# EAGLE design untitled (EAGLE 8.6.3)
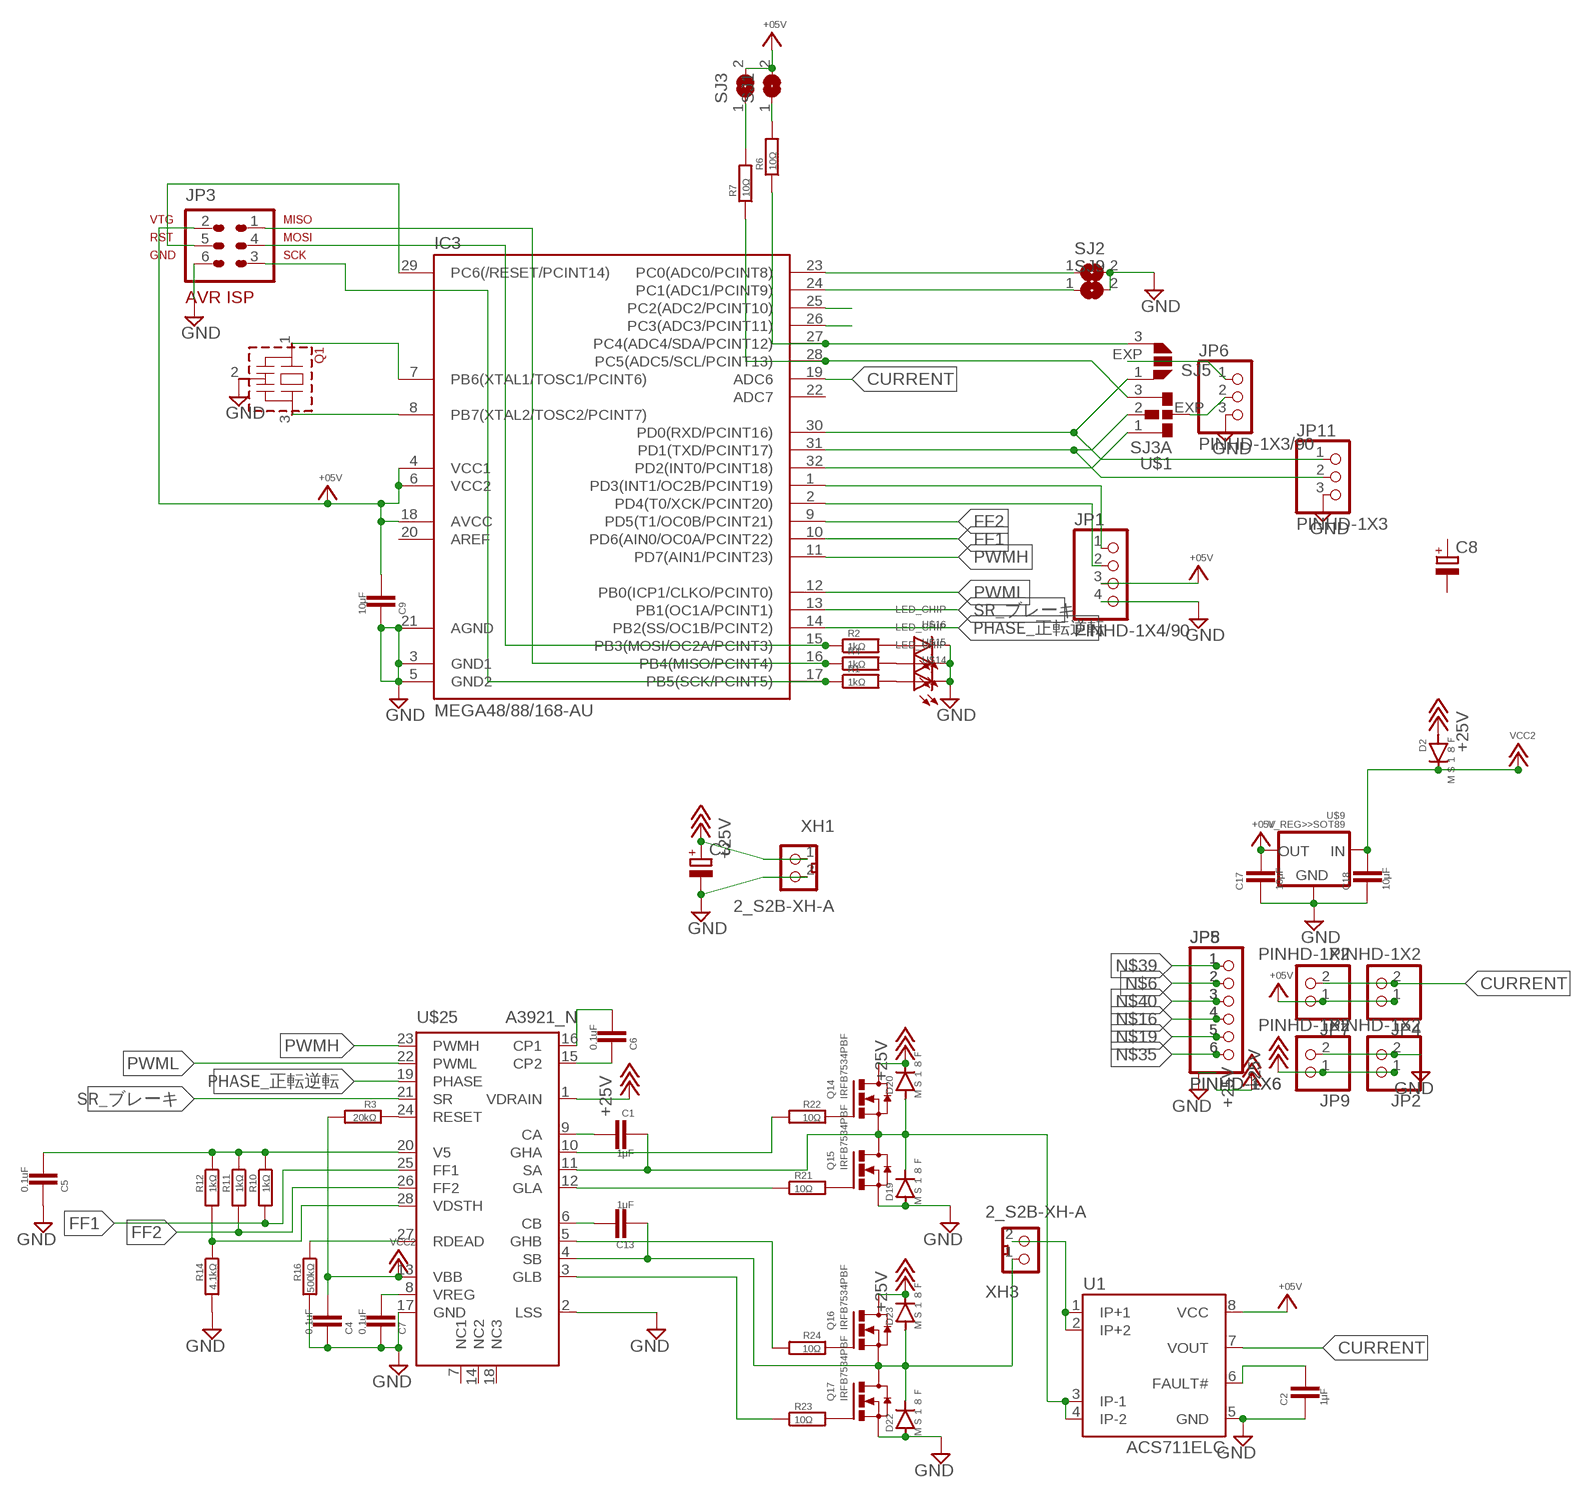
[diagram p0: schematic, sheet 1]

## Parts
C1  1μF  CAPACITOR>>2012  [2012]
C2  1μF  CAPACITOR>>2012  [2012]
C3  CPOL-EUUD-6,3X8,8  [UD-6,3X5,8_NICHICON]
C4  0.1uF  CAPACITOR>>2012  [2012]
C5  0.1uF  CAPACITOR>>2012  [2012]
C6  0.1uF  CAPACITOR>>2012  [2012]
C7  0.1uF  CAPACITOR>>2012  [2012]
C8  CPOL-EU150CLZ-1010  [150CLZ-1010]
C9  10μF  CAPACITOR>>2012  [2012]
C13  1μF  CAPACITOR>>2012  [2012]
C17  10μF  CAPACITOR>>2012  [2012]
C18  10μF  CAPACITOR>>2012  [2012]
D2  ＭＳ１８Ｆ  DIODE>>MS18F  [MS18F]
D19  ＭＳ１８Ｆ  DIODE>>MS18F  [MS18F]
D20  ＭＳ１８Ｆ  DIODE>>MS18F  [MS18F]
D22  ＭＳ１８Ｆ  DIODE>>MS18F  [MS18F]
D23  ＭＳ１８Ｆ  DIODE>>MS18F  [MS18F]
IC3  MEGA48/88/168-AU  [TQFP32-08]
JP1  PINHD-1X4/90  [1X04/90]
JP2  PINHD-1X2  [1X02]
JP3  AVR-ISP-6  [AVR-ISP-6]
JP4  PINHD-1X2  [1X02]
JP5  PINHD-1X6  [1X06]
JP6  PINHD-1X3/90  [1X03/90]
JP7  PINHD-1X2  [1X02]
JP8  PINHD-1X6  [1X06]
JP9  PINHD-1X2  [1X02]
JP11  PINHD-1X3  [1X03]
Q1  CSTLS_G  [CSTLS_G8]
Q14  IRFB7534PBF  MOSFET_N>>TO252  [TO252]
Q15  IRFB7534PBF  MOSFET_N>>TO252  [TO252]
Q16  IRFB7534PBF  MOSFET_N>>TO252  [TO252]
Q17  IRFB7534PBF  MOSFET_N>>TO252  [TO252]
R1  1kΩ  REGISTER>>2012  [2012]
R2  1kΩ  REGISTER>>2012  [2012]
R3  20kΩ  REGISTER>>2012  [2012]
R4  1kΩ  REGISTER>>2012  [2012]
R6  10Ω  REGISTER>>2012  [2012]
R7  10Ω  REGISTER>>2012  [2012]
R10  1kΩ  REGISTER>>2012  [2012]
R11  1kΩ  REGISTER>>2012  [2012]
R12  1kΩ  REGISTER>>2012  [2012]
R14  4.1kΩ  REGISTER>>2012  [2012]
R16  500kΩ  REGISTER>>2012  [2012]
R21  10Ω  REGISTER>>2012  [2012]
R22  10Ω  REGISTER>>2012  [2012]
R23  10Ω  REGISTER>>2012  [2012]
R24  10Ω  REGISTER>>2012  [2012]
SJ1  SJSS  [SJ_B]
SJ2  SJSS  [SJ_B]
SJ3  SJSS  [SJ_B]
SJ5  SJ2  [SJ2_A]
SJ9  SJSS  [SJ_B]
U1  ACS711ELC  [SOIC8]
U$1  SJ3A  [SJ3_A]
U$9  V_REG>>SOT89  [SOT89]
U$14  LED_CHIP  [2012]
U$15  LED_CHIP  [2012]
U$16  LED_CHIP  [2012]
U$25  A3921_N  [TSSOP28_N]
XH1  2_S2B-XH-A  [S2B-XH-A]
XH3  2_S2B-XH-A  [S2B-XH-A]

## Nets
+5V: C9.1 C17.1 IC3.4(VCC1) IC3.6(VCC2) IC3.18(AVCC) JP1.3 JP3.2 JP4.1 JP7.1 SJ1.2 SJ3.2 U1.8(VCC) U$9.1(OUT) ; supply symbol labelled +05V
+18V: C3.+ D2.P$1(A) D20.P$2(C) D23.P$2(C) JP2.1 JP9.1 Q14.3(D) Q16.3(D) U$25.1(VDRAIN) XH1.1 ; supply symbol labelled +25V
CURRENT: IC3.19(ADC6) JP4.2 JP7.2 U1.7(VOUT)
FF1: IC3.10(PD6(AIN0/OC0A/PCINT22)) R10.2 U$25.25(FF1)
FF2: IC3.9(PD5(T1/OC0B/PCINT21)) R11.2 U$25.26(FF2)
GND: C2.2 C3.- C4.2 C5.2 C7.2 C9.2 C17.2 C18.2 D19.P$1(A) D22.P$1(A) IC3.3(GND1) IC3.5(GND2) IC3.21(AGND) JP1.4 JP2.2 JP3.6 JP6.3 JP9.2 JP11.3 Q1.2(VSS) Q15.2(S) Q17.2(S) R14.2 R16.2 SJ2.2 SJ9.2 U1.5(GND) U$9.2(GND) U$9.2.1(GND) U$14.P$2(C) U$15.P$2(C) U$16.P$2(C) U$25.2(LSS) U$25.17(GND) XH1.2
N$1: IC3.1(PD3(INT1/OC2B/PCINT19)) JP1.1
N$2: R6.2 SJ1.1
N$3: U1.1(IP+1) U1.2(IP+2) XH3.2
N$4: C6.1 U$25.16(CP1)
N$5: IC3.29(PC6(/RESET/PCINT14)) JP3.5
N$6: C13.2 D22.P$2(C) D23.P$1(A) JP5.2 JP8.2 Q16.2(S) Q17.3(D) U$25.4(SB) XH3.1
N$7: IC3.7(PB6(XTAL1/TOSC1/PCINT6)) Q1.1
N$8: IC3.8(PB7(XTAL2/TOSC2/PCINT7)) Q1.3
N$9: R1.2 U$14.P$1(A)
N$10: IC3.2(PD4(T0/XCK/PCINT20)) JP1.2
N$11: IC3.17(PB5(SCK/PCINT5)) JP3.3 R1.1
N$14: C1.1 U$25.9(CA)
N$15: R4.2 U$15.P$1(A)
N$16: JP5.4 JP8.4 R22.2 U$25.10(GHA)
N$17: R2.2 U$16.P$1(A)
N$18: JP6.2 U$1.EXP
N$19: C1.2 D19.P$2(C) D20.P$1(A) JP5.5 JP8.5 Q14.2(S) Q15.3(D) U1.3(IP-1) U1.4(IP-2) U$25.11(SA)
N$20: R7.2 SJ3.1
N$21: IC3.15(PB3(MOSI/OC2A/PCINT3)) JP3.4 R2.1
N$22: IC3.16(PB4(MISO/PCINT4)) JP3.1 R4.1
N$23: JP6.1 SJ5.EXP
N$24: IC3.32(PD2(INT0/PCINT18)) U$1.1
N$25: IC3.23(PC0(ADC0/PCINT8)) SJ2.1
N$26: IC3.24(PC1(ADC1/PCINT9)) SJ9.1
N$27: IC3.31(PD1(TXD/PCINT17)) JP11.2 U$1.2
N$28: IC3.30(PD0(RXD/PCINT16)) JP11.1 SJ5.1
N$29: C6.2 U$25.15(CP2)
N$30: IC3.28(PC5(ADC5/SCL/PCINT13)) R7.1 U$1.3
N$31: IC3.27(PC4(ADC4/SDA/PCINT12)) R6.1 SJ5.3
N$32: IC3.25(PC2(ADC2/PCINT10))
N$33: IC3.26(PC3(ADC3/PCINT11))
N$35: JP5.6 JP8.6 R21.1 U$25.12(GLA)
N$36: R3.1 U$25.24(RESET)
N$37: C7.1 U$25.8(VREG)
N$39: JP5.1 JP8.1 R24.2 U$25.5(GHB)
N$40: JP5.3 JP8.3 R23.1 U$25.3(GLB)
N$41: C13.1 U$25.6(CB)
N$43: R12.2 R14.1 U$25.28(VDSTH)
N$50: Q15.1(G) R21.2
N$51: R16.1 U$25.27(RDEAD)
N$52: C2.1 U1.6(FAULT#)
N$54: Q14.1(G) R22.1
N$56: Q17.1(G) R23.2
N$60: Q16.1(G) R24.1
PHASE_正転逆転: IC3.14(PB2(SS/OC1B/PCINT2)) U$25.19(PHASE)
PWMH: IC3.11(PD7(AIN1/PCINT23)) U$25.23(PWMH)
PWML: IC3.12(PB0(ICP1/CLKO/PCINT0)) U$25.22(PWML)
SR_ブレーキ: IC3.13(PB1(OC1A/PCINT1)) U$25.21(SR)
V5: C5.1 R10.1 R11.1 R12.1 U$25.20(V5)
VCC2: C4.1 C18.1 D2.P$2(C) R3.2 U$9.3(IN) U$25.13(VBB)
Unconnected: C8.+ C8.- IC3.20(AREF) IC3.22(ADC7) U$25.7(NC1) U$25.14(NC2) U$25.18(NC3)

## Library data of the parts
C1 C2 C4-C7 C9 C13 C17 C18 = !SMD:CAPACITOR>>
C3 C8 = !rcl:CPOL-EU: POLARIZED CAPACITOR, European symbol
D2 D19 D20 D22 D23 = !diode:DIODE>>: DIODE
IC3 = !avr:MEGA48/88/168
JP1 = !pinhead(ﾋﾟﾝﾍｯﾀﾞ):PINHD-1X4: PIN HEADER
JP2 JP4 JP7 JP9 = !pinhead(ﾋﾟﾝﾍｯﾀﾞ):PINHD-1X2: PIN HEADER
JP3 = !avr:AVR-ISP-6: AVR ISP-6 Serial Programming Header
JP5 JP8 = !pinhead(ﾋﾟﾝﾍｯﾀﾞ):PINHD-1X6: PIN HEADER
JP6 JP11 = !pinhead(ﾋﾟﾝﾍｯﾀﾞ):PINHD-1X3: PIN HEADER
Q1 = !murata-resonators(ｾﾗﾛｯｸ):CSTLS_G: Ceramic resonator 2.00 to 10.00 MHz
Q14-Q17 = !FET_transister_v-reg:MOSFET_N>>
R1-R4 R6 R7 R10-R12 R14 R16 R21-R24 = !SMD:REGISTER>>
SJ1-SJ3 SJ9 = !jumper:SJ: SMD solder JUMPER
SJ5 = !jumper:SJ2: SMD solder JUMPER
U1 = allegro:ACS711E: SENSOR CURRENT 3.3V 8-SOIC tested: YES (etherbotix)
U$1 = !jumper:SJ3
U$9 = !FET_transister_v-reg:V_REG>>
U$14-U$16 = !led:LED_CHIP
U$25 = !irs(GateDriver):A3921_N
XH1 XH3 = !con-xh:2_: Wire-to-Board 2.5mm pitch top mount connector Source: http://www.jst-mfg.com/product/pdf/jpn/XH.pdf http://www.jst-mfg.com/product/detail.php?series=277

## Board
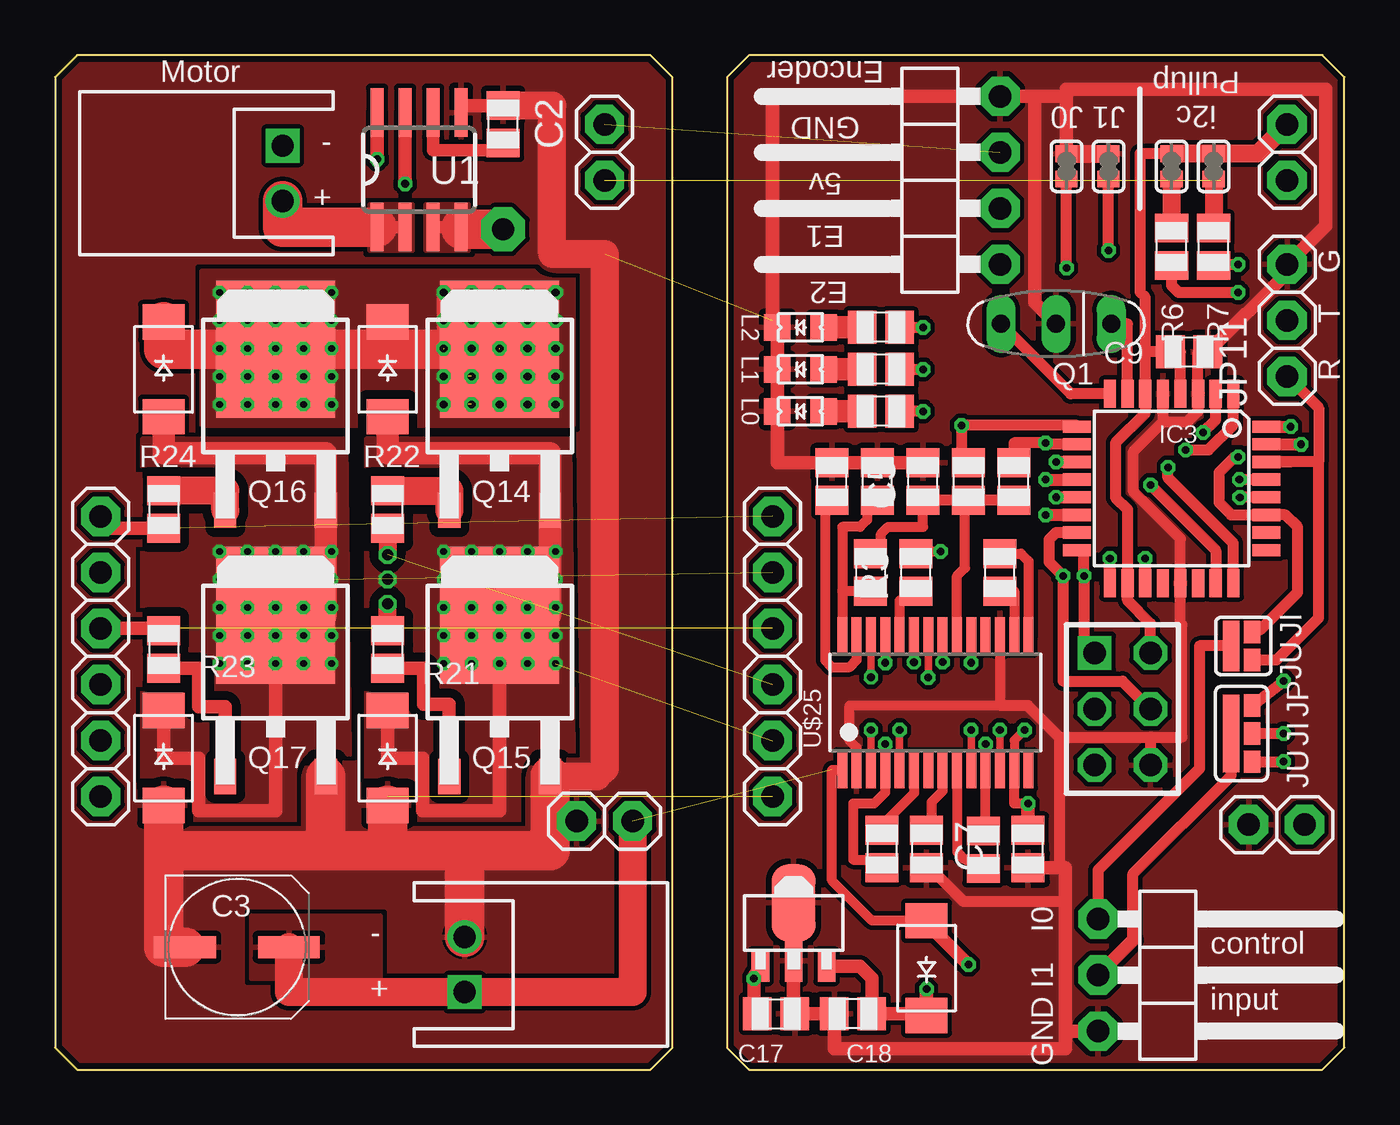
[diagram p1: board, top side]
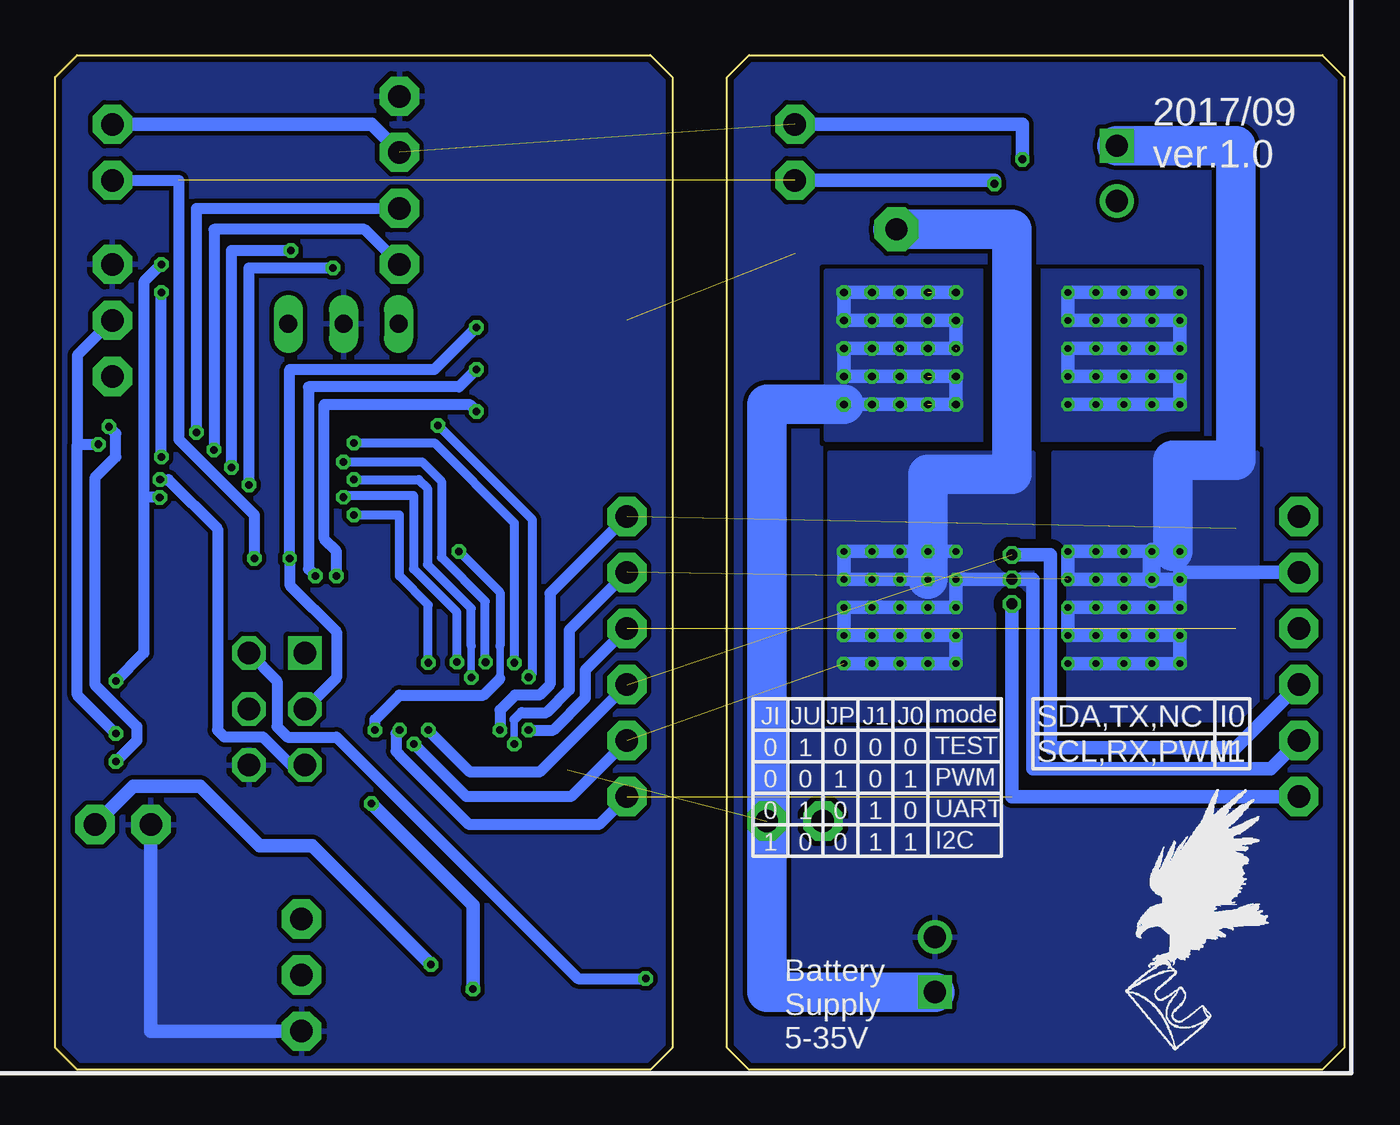
[diagram p2: board, bottom side, seen from below]

Size 58.48 x 46 mm. Coordinates in mm from the lower left corner, seen from the top.
Outline: 28,1 28,45 27,46 1,46 0,45 0,1 1,0 27,0 28,1
Outline: 58.48,1 58.48,45 57.48,46 31.48,46 30.48,45 30.48,1 31.48,0 57.48,0 58.48,1
Copper layers (1*16): Top 0.035mm / dielectric 1.5mm / Bottom 0.035mm
Design rules "SeeedStudio_2layer_DRU_no_angle_20140221": minimum track width 6mil, minimum drill 12mil, track to track 6mil, track to pad 6mil, pad to pad 6mil, via to via 6mil, smd to smd 0mil, copper to edge 10mil, drill to drill 10mil, minimum pad ring 10mil, minimum via ring 6mil, stop-mask expansion 2mil, vias tented up to drill 100mil, thermal gap 10mil

### Footprints (pad centres in the part's own frame; a part is rotated, then mirrored left to right if it is on the bottom)
2012 = smd 1.3 x 1.5: 1 -0.85,0; 2 0.85,0
UD-6,3X5,8_NICHICON = smd 2.8 x 1: + 2.35,0; - -2.35,0
150CLZ-1010 = smd 4.3 x 2.5: + 4.15,0; - -4.15,0
MS18F = smd 1.6 x 1.9: P$1 -2.15,0; P$2 2.15,0
TQFP32-08 = smd 1.27 x 0.559: 1 -4.293,2.8; 2 -4.293,2; 3 -4.293,1.2; 4 -4.293,0.4; 5 -4.293,-0.4; 6 -4.293,-1.2; 7 -4.293,-2; 8 -4.293,-2.8; 17 4.293,-2.8; 18 4.293,-2; 19 4.293,-1.2; 20 4.293,-0.4; 21 4.293,0.4; 22 4.293,1.2; 23 4.293,2; 24 4.293,2.8 | smd 0.559 x 1.27: 9 -2.8,-4.293; 10 -2,-4.293; 11 -1.2,-4.293; 12 -0.4,-4.293; 13 0.4,-4.293; 14 1.2,-4.293; 15 2,-4.293; 16 2.8,-4.293; 25 2.8,4.293; 26 2,4.293; 27 1.2,4.293; 28 0.4,4.293; 29 -0.4,4.293; 30 -1.2,4.293; 31 -2,4.293; 32 -2.8,4.293
1X04/90 = drill 1.016 pad 1.778 octagon: 1 -3.81,-3.81; 2 -1.27,-3.81; 3 1.27,-3.81; 4 3.81,-3.81
1X02 = drill 1.016 pad 1.778 octagon: 1 -1.27,0; 2 1.27,0
AVR-ISP-6 = drill 1.016 square: 1 -2.54,-1.27 | drill 1.016 octagon: 2 -2.54,1.27; 3 0,-1.27; 4 0,1.27; 5 2.54,-1.27; 6 2.54,1.27
1X06 = drill 1.016 pad 1.778 octagon: 1 -6.35,0; 2 -3.81,0; 3 -1.27,0; 4 1.27,0; 5 3.81,0; 6 6.35,0
1X03/90 = drill 1.016 pad 1.778 octagon: 1 -2.54,-3.81; 2 0,-3.81; 3 2.54,-3.81
1X03 = drill 1.016 pad 1.778 octagon: 1 -2.54,0; 2 0,0; 3 2.54,0
CSTLS_G8 = drill 0.813 long: 1 -2.5,0; 2 0,0; 3 2.5,0
TO252 = smd 1 x 1.6: 1 -2.28,-4.8; 2 2.28,-4.8 | smd 5.4 x 6.2: 3 0,2.5
SJ_B = smd 0.75 x 1: 1 -0.572,0; 2 0.572,0
SJ2_A = smd 1 x 0.75: 1 -0.635,-0.953; 3 0.635,-0.953 | smd 2.3 x 0.75: EXP 0,0
SOIC8 = smd 0.6 x 2.2: 1 -1.905,-2.6; 2 -0.635,-2.6; 3 0.635,-2.6; 4 1.905,-2.6; 5 1.905,2.6; 6 0.635,2.6; 7 -0.635,2.6; 8 -1.905,2.6
SJ3_A = smd 1 x 0.75: 1 -1.111,-0.953; 2 0.159,-0.953; 3 1.429,-0.953 | smd 3.5 x 0.75: EXP 0.159,0
SOT89 = smd 0.8 x 1.4: 1 -1.499,-1.981; 3 1.499,-1.981 | smd 0.8 x 1.9: 2 0,-1.727 | smd 2 x 3.5: 2.1 0,0.889
2012' = smd 1.2 x 1.2: P$1 -1.05,0; P$2 1.05,0
TSSOP28_N = smd 0.45 x 1.65: 1 -4.225,-3.05; 2 -3.575,-3.05; 3 -2.925,-3.05; 4 -2.275,-3.05; 5 -1.625,-3.05; 6 -0.975,-3.05; 7 -0.325,-3.05; 8 0.325,-3.05; 9 0.975,-3.05; 10 1.625,-3.05; 11 2.275,-3.05; 12 2.925,-3.05; 13 3.575,-3.05; 14 4.225,-3.05; 15 4.225,3.05; 16 3.575,3.05; 17 2.925,3.05; 18 2.275,3.05; 19 1.625,3.05; 20 0.975,3.05; 21 0.325,3.05; 22 -0.325,3.05; 23 -0.975,3.05; 24 -1.625,3.05; 25 -2.275,3.05; 26 -2.925,3.05; 27 -3.575,3.05; 28 -4.225,3.05
S2B-XH-A = drill 1.016 square: 1 1.25,0 | drill 1.016: 2 -1.25,0

### Placement (x,y rotation side)
C1  42.1,9.96 90 top
C2  20.32,42.86 90 top
C3  8.26,5.56 0 top
C4  44.13,10 270 top
C5  39.37,26.67 90 top
C6  42.86,22.54 90 top
C7  39.53,10 270 top
C8  -9.52,6.03 0 top  (outside the outline)
C9  51.44,32.54 0 top
C13  37.5,10 270 top
C17  32.7,2.54 0 top
C18  36.2,2.54 180 top
D2  39.53,4.6 270 top
D19  15.08,14.13 90 top
D20  15.08,31.75 90 top
D22  4.92,14.13 90 top
D23  4.92,31.75 90 top
IC3  50.64,26.35 270 top
JP1  39.05,40.32 90 top
JP2  55.4,11.11 180 top
JP3  48.42,16.35 270 top
JP4  55.88,41.59 270 top
JP5  32.54,18.73 270 top
JP6  51.12,4.29 270 top
JP7  24.92,41.59 270 top
JP8  2.06,18.73 270 top
JP9  24.92,11.27 180 top
JP11  55.88,33.97 90 top
Q1  45.4,33.81 180 top
Q14  20.16,30.16 0 top
Q15  20.16,18.1 0 top
Q16  10,30.16 0 top
Q17  10,18.1 0 top
R1  37.47,33.66 180 top
R2  37.47,29.84 180 top
R3  39.05,22.54 90 top
R4  37.47,31.75 180 top
R6  50.64,37.31 90 top
R7  52.55,37.31 90 top
R10  43.5,26.67 90 top
R11  41.43,26.67 90 top
R12  36.99,22.54 270 top
R14  37.31,26.67 90 top
R16  35.24,26.67 90 top
R21  15.08,19.05 270 top
R22  15.08,25.4 270 top
R23  4.92,19.05 270 top
R24  4.92,25.4 270 top
SJ1  50.64,40.96 90 top
SJ2  45.88,40.96 90 top
SJ3  52.55,40.96 90 top
SJ5  53.34,19.21 90 top
SJ9  47.78,40.96 90 top
U1  16.51,40.8 0 top
U$1  53.34,15.08 90 top
U$9  33.5,6.67 0 top
U$14  LED_CHIP  [2012']  33.81,33.66 180 top
U$15  LED_CHIP  [2012']  33.81,31.75 180 top
U$16  LED_CHIP  [2012']  33.81,29.84 180 top
U$25  39.93,16.64 0 top
XH1  18.57,4.76 270 top
XH3  10.32,40.64 90 top

### Tracks (layer width: path | path; a pad name or v marks a point on that pad's centre or on a via)
+5V  (via drill 0.35)  (1 unrouted)
  Top 0.508: IC3.4 51.04,32.54 C9.1 | 49.44,32.54 IC3.6 49.44,29.76 48.1,28.42 48.1,25.94 48.64,25.4 IC3.18 48.64,21.27 49.69,20.23 JP3.2 | 50.08,32.54 C9.1 | C9.1 49.44,32.54 | SJ1.2 49.21,41.53 49.21,35.25 49.44,35.02 49.44,32.54
  Top 0.61: U1.8 v14.6,41.27 | U$9.1 31.69,4.21 v31.69,4.13 31.69,2.54 C17.1
  Top 0.813: SJ1.2 SJ3.2 54.55,41.53 JP4.1
  Bottom 0.508: JP3.2 48.42,17.62 48.42,15.56 47.94,15.08 45.72,15.08 34.77,4.13 v31.69,4.13
  Bottom 0.61: JP7.1 14.6,42.86 v14.6,41.27 | JP4.1 44.13,42.86 JP1.3
+18V  (via drill 0.3, 0.35)  (6 unrouted)
  Top 0.457: D2.P$1 37.06,6.75 35.24,8.57 35.24,13.59 U$25.1
  Top 0.61: Q16.3 v10,31.43 | Q14.3 17.62,32.66 v17.62,35.24 | v41.43,4.76 39.53,6.67 D2.P$1
  Top 1.27: 16.99,32.66 15.08,32.66 D20.P$2 | v10,33.97 Q16.3 9.7,33.3 | JP9.1 26.19,3.51 XH1.1 10.6,3.51 C3.+
  Top 1.8: Q14.3 16.99,32.66 Q16.3 4.92,32.66 D23.P$2
  Bottom 0.61: v7.46,35.24 v8.73,35.24 v10,35.24 v11.27,35.24 v12.54,35.24 v12.54,33.97 v11.27,33.97 v10,33.97 v8.73,33.97 v7.46,33.97 v7.46,32.7 v8.73,32.7 | 8.57,32.7 v10,32.7 v11.27,32.7 v12.54,32.7 v12.54,31.43 v11.27,31.43 v10,31.43 v8.73,31.43 v7.46,31.43 v7.46,30.16 v8.73,30.16 v10,30.16 v11.27,30.16 v12.54,30.16 | v17.62,35.24 18.73,35.24 | v18.89,35.24 v20.16,35.24 v21.43,35.24 v22.7,35.24 v22.7,33.97 v21.43,33.97 v20.16,33.97 v18.89,33.97 | 18.73,33.97 v17.62,33.97 v17.62,32.7 18.73,32.7 | v18.89,32.7 v20.16,32.7 v21.43,32.7 v22.7,32.7 v22.7,31.43 v21.43,31.43 v20.16,31.43 v18.89,31.43 | 18.73,31.43 v17.62,31.43 v17.62,30.16 18.73,30.16 | v18.89,30.16 v20.16,30.16 v21.43,30.16 v22.7,30.16 | JP2.1 54.93,12.86 51.91,12.86 49.21,10.16 46.83,10.16 v41.43,4.76
  Bottom 1.8: 24.92,30.16 v22.7,30.16 26.19,30.16 JP9.1 26.19,3.51 XH1.1
  pour Top (isolate 0.406, rank 2, no thermals): 23.5,36.2 6.67,36.2 6.67,29.21 23.5,29.21
  pour Bottom (isolate 0.406, rank 2, no thermals): 6.67,36.2 23.5,36.2 23.5,28.58 6.67,28.58
  pour Top (isolate 0.406): 8.89,6.98 14.76,6.98 14.76,4.13 8.89,4.13
CURRENT  (via drill 0.35)  (1 unrouted)
  Top 0.55: IC3.19 v49.44,23.18
  Top 0.61: U1.7 v15.87,40.16
  Bottom 0.508: JP4.2 52.86,40.32 52.86,28.57 49.44,25.15 v49.44,23.18
  Bottom 0.61: JP7.2 15.87,40.32 v15.87,40.16
FF1  (via drill 0.35)
  Top 0.457: U$25.25 v37.65,18.45
  Top 0.508: IC3.10 44.93,28.35 v44.93,28.42 43.5,28.42 R10.2
  Bottom 0.406: v44.93,28.42 41.27,28.42 37.65,24.8 v37.65,18.45
FF2  (via drill 0.35)
  Top 0.34: U$25.26 v37,17.8
  Top 0.508: IC3.9 46.35,29.21 v41.12,29.21 41.12,27.52 R11.2
  Bottom 0.406: v37,17.8 36.83,17.97 36.83,24.92 v41.12,29.21
GND  (1 unrouted)
  Top 0.457: U$25.2 36.35,14.6 36.04,14.92 36.04,16.51 42.85,16.51 U$25.17 | U$9.2 U$9.2.1
  Top 0.508: C9.2 51.84,32.54 IC3.3 51.84,29.84 51.36,29.37 50.25,29.37 | U$14.P$2 32.54,33.72 32.54,33.97 | 49.69,15.08 51.12,15.08 51.12,20.16 51.04,20.16 IC3.21 51.04,24.07 48.92,26.19 48.92,28.04 50.25,29.37 | 49.69,15.08 JP3.6 | 50.24,29.77 IC3.5 50.24,29.38 50.25,29.37 | 45.81,7.62 41.22,7.62 39.69,9.15 C7.2 | 45.56,15.08 49.69,15.08 | 45.56,15.08 45.56,9.15 | 42.85,16.51 44.13,16.51 45.56,15.08
  Top 0.559: 20.32,43.4 C2.2
  Top 0.61: C2.2 18.41,43.71 U1.5 | 32.54,33.97 32.54,44.13 JP1.4 44.45,44.13 | 45.81,1.75 45.81,7.62 45.81,9.15 C4.2 | JP6.3 45.81,1.75 | U$9.2 33.5,2.22 C17.2 C18.2 35.34,0.95 45.81,0.95 45.81,1.75 | 34.13,7.08 U$9.2.1 | 44.45,44.13 45.88,44.13 | 45.88,44.13 SJ2.2 | 44.45,44.13 44.45,34.77 Q1.2 | C5.2 R14.2 R16.2 32.76,27.52 U$16.P$2 U$15.P$2 U$14.P$2 | 45.88,44.13 45.88,44.45 57.63,44.45 57.63,38.26 JP11.3 55.88,36.14 C9.2
  Top 0.813: SJ2.2 SJ9.2
  Top 1.27: C2.2 22.54,43.71 22.54,36.99 24.92,36.99 24.92,13.65 24.57,13.3 Q15.2 22.44,11.27 22.44,9.92 22.44,9.84 | 18.55,6.03 XH1.2
  Top 1.8: 18.57,9.92 22.44,9.92 Q15.2 | XH1.2 18.57,9.92 | 18.57,9.92 15.08,9.92 | 15.08,10 D19.P$1 15.08,9.92 | 15.08,9.92 12.28,9.92 | C3.- 4.92,5.56 4.92,10.29 | 4.92,10.29 D22.P$1 | 12.28,9.92 5.29,9.92 4.92,10.29 | JP9.2 22.44,11.27 | 12.28,9.92 Q17.2
  Bottom 0.61: JP2.2 54.13,1.75 JP6.3
  pour Bottom (isolate 0.203, rank 6): 28,1 27,0 1,0 0,1 0,45 1,46 27,46 28,45
  pour Top (isolate 0.203, rank 6): 28,1 27,0 1,0 0,1 0,45 1,46 27,46 28,45
  pour Top (isolate 0.203, rank 6): 58.48,1 57.48,0 31.48,0 30.48,1 30.48,45 31.48,46 57.48,46 58.48,45
  pour Bottom (isolate 0.203, rank 6): 58.48,1 57.48,0 31.48,0 30.48,1 30.48,45 31.48,46 57.48,46 58.48,45
N$1  (via drill 0.35)
  Top 0.508: v51.28,28.1 52.31,28.1 53.44,29.23 IC3.1
  Bottom 0.508: JP1.1 44.45,38.1 51.28,38.1 v51.28,28.1
N$2
  Top 0.813: SJ1.1 R6.2
N$3
  Top 0.559: U1.2 U1.1
  Top 1.8: U1.1 10.32,38.2 XH3.2
  pour Top (isolate 0.406, rank 2, no thermals): 14.29,39.21 16.19,39.21 16.19,37.15 14.29,37.15
N$4
  Top 0.457: C6.1 43.5,21.69 U$25.16
N$5  (via drill 0.35)
  Top 0.508: IC3.29 v53.72,26.75
  Bottom 0.508: JP3.5 47.78,13.81 49.05,15.08 50.8,15.08 51.12,15.4 51.12,24.52 53.35,26.75 v53.72,26.75
N$6  (via drill 0.3, 0.35)  (1 unrouted)
  Top 0.457: v37.65,14.76 U$25.4 37.65,12.57 37.15,12.07 36.19,12.07 36.19,9.52 37.5,9.52 C13.2
  Top 0.61: 10,18.57 10,11.75 6.51,11.75 6.51,14.13 4.92,14.13 D22.P$2
  Top 0.813: 10,18.57 Q17.3
  Top 1.016: Q16.2 12.28,20.6 Q17.3 | 12.28,25.4 Q16.2 | Q16.2 12.28,27.94 4.92,27.94 D23.P$1
  Bottom 0.34: v37.65,14.76 37.65,15.87
  Bottom 0.457: 37.65,15.87 37.34,16.19 37.31,16.19
  Bottom 0.508: 37.31,16.19 36.19,16.19 35.16,17.22 35.16,19.92 JP5.2
  Bottom 0.61: v7.46,23.49 v8.73,23.49 v10,23.49 v11.27,23.49 v12.54,23.49 v12.54,22.23 v11.27,22.23 v10,22.23 v8.73,22.23 v7.46,22.23 | v12.54,18.42 v11.27,18.42 v10,18.42 v8.73,18.42 v7.46,18.42 v7.46,19.69 v8.73,19.69 v10,19.69 v11.27,19.69 v12.54,19.69 v12.54,20.96 v11.27,20.96 v10,20.96 v8.73,20.96 v7.46,20.96 v7.46,22.23 | JP8.2 7.46,22.54 v7.46,22.23
  Bottom 0.813: v8.73,22.23 v8.73,23.49
  Bottom 1.8: 7.78,23.49 7.78,27.62 4.92,27.62 4.92,41.89 XH3.1
  pour Top (isolate 0.406, rank 3, no thermals): 3.97,28.58 3.97,11.11 11.11,11.11 11.11,14.29 13.34,14.29 13.18,28.58
  pour Bottom (isolate 0.406, rank 3, no thermals): 3.97,15.88 3.97,27.94 13.18,27.94 13.18,15.88
N$7
  Top 0.508: IC3.7 48.64,33.81 Q1.1
N$8
  Top 0.508: IC3.8 46.07,30.65 Q1.3
N$9
  Top 1.016: R1.2 U$14.P$1
N$10  (via drill 0.35)
  Top 0.508: v52.07,28.89 52.64,29.46 IC3.2
  Bottom 0.508: v52.07,28.89 52.07,39.05 JP1.2
N$11  (via drill 0.35)
  Top 0.508: IC3.17 | R1.1 v39.37,33.65
  Top 0.55: IC3.17 v47.84,23.18
  Bottom 0.508: v39.37,33.65 41.27,31.75 47.84,31.75 v47.84,23.18 47.84,21.96 45.72,19.84 45.72,17.78 JP3.3
N$14
  Top 0.457: C1.1 42.1,9.52 41.27,9.52 40.9,9.89 U$25.9
N$15
  Top 1.016: U$15.P$1 R4.2
N$16  (via drill 0.35, 0.5)  (1 unrouted)
  Top 0.34: v41.55,15.4 U$25.10
  Top 0.813: R22.2 v15.08,23.34
  Bottom 0.508: v41.55,15.4 39.65,13.49 36.51,13.49 JP5.4
  Bottom 0.61: v15.08,23.34 13.33,23.34 13.33,14.6 4.92,14.6 JP8.4
N$17
  Top 1.016: U$16.P$1 R2.2
N$18
  Top 0.508: 48.89,5.87 48.89,8.89 53.34,13.33 U$1.EXP
  Top 0.61: 48.89,5.87 JP6.2
N$19  (via drill 0.3, 0.35, 0.5, 1 pad 2)  (1 unrouted)
  Top 0.457: U$25.11 v42.2,14.76 42.2,10.81 C1.2
  Top 0.559: U1.3 U1.4
  Top 0.61: Q15.3 21.11,22.23 | 20.16,18.26 20.16,11.75 16.67,11.75 16.67,14.13 15.08,14.13 D19.P$2
  Top 0.813: 20.16,18.26 Q15.3
  Top 1.016: 22.44,25.4 Q14.2 | Q14.2 22.44,20.6 Q15.3 | D20.P$1 15.08,27.94 22.44,27.94 Q14.2
  Top 1.8: U1.4 18.41,38.1 v20.32,38.1
  Bottom 0.508: v42.2,14.76 39.82,12.38 35.08,12.38 JP5.5
  Bottom 0.61: v18.89,18.42 v21.43,18.42 v22.7,18.42 | v20.16,18.42 v18.89,18.42 | v18.89,18.42 v17.62,18.42 v17.62,19.69 v18.89,19.69 v20.16,19.69 v21.43,19.69 v22.7,19.69 v22.7,20.96 v21.43,20.96 v20.16,20.96 v18.89,20.96 v17.62,20.96 v17.62,22.23 v15.08,22.23 14.13,22.23 14.13,13.65 3.33,13.65 JP8.5 | v17.62,23.49 v18.89,23.49 v20.16,23.49 v21.43,23.49 v22.7,23.49 v22.7,22.23 v21.43,22.23 v20.16,22.23 v18.89,22.23
  Bottom 0.813: v18.89,23.49 v18.89,22.23
  Bottom 1.8: 20.48,38.1 v20.32,38.1 15.08,38.1 15.08,26.99 18.89,26.99 v18.89,22.23
  pour Top (isolate 0.406, rank 3, no thermals): 14.13,11.11 21.27,11.11 21.27,14.29 23.5,14.29 23.34,28.58 14.13,28.58
  pour Bottom (isolate 0.406, rank 3, no thermals): 14.13,27.94 23.34,27.94 23.34,15.88 14.13,15.88
  pour Top (isolate 0.406, no thermals): 16.83,39.21 18.73,39.21 18.73,37.15 16.83,37.15
N$20
  Top 0.813: SJ3.1 R7.2
N$21  (via drill 0.35)
  Top 0.508: v39.37,29.84 R2.1 | JP3.4 48.42,17.62 45.72,17.62 v45.72,22.38 45.08,23.02 45.08,24.03 45.4,24.35 | IC3.15 45.4,24.35 | 45.4,24.35
  Bottom 0.508: v39.37,29.84 39.69,30.16 46.28,30.16 46.28,24.05 45.72,23.49 v45.72,22.38
N$22  (via drill 0.35)
  Top 0.508: R4.1 v39.37,31.75 | IC3.16 46.67,23.55 v46.67,22.38 46.67,19.37 JP3.1
  Bottom 0.508: v39.37,31.75 40.16,30.96 46.99,30.96 46.99,22.7 v46.67,22.38
N$23
  Top 0.508: SJ5.EXP 51.91,19.21 51.91,13.65 47.31,9.05 JP6.1
N$24  (via drill 0.35)
  Top 0.508: U$1.1 v55.72,13.97
  Top 0.55: IC3.32 v56.04,29.15
  Bottom 0.508: v56.04,29.15 55.72,28.83 55.72,27.78 56.67,26.83 56.67,17.46 54.77,15.56 54.77,14.92 v55.72,13.97
N$25  (via drill 0.35)
  Top 0.508: v45.88,36.35 SJ2.1 | v49.69,26.51 52.64,23.56 IC3.23
  Bottom 0.508: v45.88,36.35 49.69,36.35 v49.69,26.51
N$26  (via drill 0.35)
  Top 0.508: v47.78,37.15 SJ9.1 | IC3.24 53.44,23.87 50.48,26.83 v50.48,27.31
  Bottom 0.508: v47.78,37.15 50.48,37.15 v50.48,27.31
N$27  (via drill 0.35)
  Top 0.508: v55.72,15.24 U$1.2
  Top 0.55: IC3.31 v56.51,28.35
  Bottom 0.508: 57.47,28.35 v56.51,28.35 | v55.72,15.24 57.47,16.99 57.47,28.35 | JP11.2 57.47,32.39 57.47,28.35
N$28
  Top 0.508: 56.04,27.55 IC3.30 57.31,27.55 | 57.31,27.55 57.31,20.48 55.4,18.57 SJ5.1 | JP11.1 57.31,30 57.31,27.55
N$29
  Top 0.457: C6.2 43.81,23.39 44.15,23.05 U$25.15
N$30  (via drill 0.35)
  Top 0.508: U$1.3 v55.72,17.62 | R7.1 52.55,36.51 v53.66,36.51 | IC3.28 v53.73,25.95
  Bottom 0.508: v55.72,17.62 54.45,18.89 54.45,24.92 54.45,25.95 | v53.66,36.51 54.45,35.72 54.45,25.95 | v53.73,25.95 54.45,25.95
N$31  (via drill 0.35)
  Top 0.508: IC3.27 | R6.1 50.64,35.56 50.96,35.24 v53.66,35.24 | SJ5.3 54.68,19.96 56.36,21.64 56.36,24.61 55.81,25.15 IC3.27 | v53.66,27.78 53.5,27.78 52.78,27.07 52.78,25.72 53.35,25.15 IC3.27
  Bottom 0.508: v53.66,27.78 v53.66,35.24
N$35  (via drill 0.35, 0.5)  (1 unrouted)
  Top 0.34: U$25.12 v42.85,15.4
  Top 0.813: R21.1 v15.08,21.11
  Bottom 0.34: 42.85,14.29 42.87,14.28
  Bottom 0.508: v42.85,15.4 43.02,15.23 43.02,14.45 42.87,14.29 42.87,14.28 39.7,11.11 33.81,11.11 JP5.6
  Bottom 0.61: JP8.6 15.08,12.38 v15.08,21.11
N$36
  Top 0.457: R3.1 39.05,21.27 38.3,21.27 U$25.24
N$37
  Top 0.457: U$25.8 40.25,12.63 39.77,12.14 39.77,11.09 C7.1
N$39  (via drill 0.35)  (1 unrouted)
  Top 0.34: U$25.5 v38.3,15.4
  Top 0.61: JP8.1 2.6,24.55 R24.2
  Bottom 0.508: JP5.1 36.04,21.59 36.04,17.46 36.51,16.99 37.62,16.99 38.3,16.3 v38.3,15.4
N$40  (via drill 0.35)  (1 unrouted)
  Top 0.34: U$25.3 v37,15.4
  Top 0.61: JP8.3 4.92,20 R23.1
  Bottom 0.508: v37,15.4 35.88,15.4 34.43,16.84 34.43,18.11 JP5.3
N$41
  Top 0.457: U$25.6 38.95,12.54 37.5,11.08 C13.1
N$43
  Top 0.457: 35.7,21.69 U$25.28 | 35.7,21.69 35.7,24.61 36.51,24.61 36.83,24.92 36.83,25.82 R14.1 | R12.2 35.7,21.69
N$50
  Top 0.61: R21.2 16.72,18.2 16.72,16.56 17.88,16.56 Q15.1
N$51
  Top 0.457: U$25.27 36.35,18.57 36.04,18.26 35.24,18.26 34.92,18.57 34.92,25.82 R16.1
N$52
  Top 0.559: C2.1 20.32,41.75 20.26,41.69 17.14,41.69 U1.6
N$54
  Top 1.27: R22.1 17.88,26.25 Q14.1
N$56
  Top 0.61: Q17.1 7.72,16.45 6.51,16.45 6.51,18.2 R23.2
N$60
  Top 1.27: Q16.1 7.72,26.25 R24.1
PHASE_正転逆転  (via drill 0.35)
  Top 0.457: U$25.19 v41.55,18.45
  Top 0.55: v44.93,25.15 IC3.14
  Bottom 0.406: v44.93,25.15 42.86,25.15 42.86,22.38 41.55,21.08 v41.55,18.45
PWMH  (via drill 0.35)
  Top 0.457: U$25.23 v38.95,18.48
  Top 0.55: v45.4,27.55 IC3.11
  Bottom 0.406: 38.97,18.49 38.97,21.24 40.96,23.22 40.96,26.67 41.84,27.55 v45.4,27.55
  Bottom 0.457: v38.95,18.48 38.97,18.49
PWML  (via drill 0.35)
  Top 0.34: U$25.22 v39.6,17.78
  Top 0.55: v44.93,26.75 IC3.12
  Bottom 0.34: v39.6,17.78 39.6,19.21
  Bottom 0.406: 39.6,19.21 39.6,20.91 41.59,22.9 41.59,26.35 41.99,26.75 v44.93,26.75
SR_ブレーキ  (via drill 0.35)
  Top 0.457: U$25.21 v40.25,18.48
  Top 0.55: v45.4,25.95 IC3.13
  Bottom 0.406: v40.25,18.48 40.25,20.73 42.23,22.7 42.23,26.04 45.32,26.04 v45.4,25.95
V5
  Top 0.457: U$25.20 40.9,22.38 41.27,22.75 41.27,25.82 | C5.1 39.37,24.61 37.78,24.61 37.46,24.29 37.46,23.39 R12.1
  Top 0.508: R10.1 R11.1 41.27,25.82 C5.1
VCC2  (via drill 0.35)
  Top 0.34: 43.5,13.65 43.5,13.33
  Top 0.406: v43.97,15.4 43.5,14.93 43.5,13.65
  Top 0.457: 39.53,2.22 D2.P$2 | C4.1 43.97,11.11 | U$25.13 43.5,13.33 43.5,12.07 v44.13,12.07 | R3.2 39.05,23.49 v40.16,23.49
  Top 0.61: v39.53,3.65 D2.P$2 | U$9.3 36.51,4.69 37.04,4.15 C18.1 39.53,2.54 39.53,2.22 | v44.13,12.07 C4.1
  Bottom 0.34: 38.3,17.73 38.3,19.21
  Bottom 0.406: v40.16,23.49 38.3,21.64 38.3,19.21
  Bottom 0.508: v43.97,15.4 43.97,15.87 42.86,16.99 39.05,16.99 38.3,17.73
  Bottom 0.61: v44.13,12.07 39.53,7.46 v39.53,3.65

### Text on the board
tNames: Encoder | Motor | J0 | J1 | i2c / Pullup | GND | - | 5v | + | E1 | G | E2 | L2 | T | L1 | R | L0 | JI | JU | JP | JI | JU | I0 | - | control | I1 | + | input | GND
bNames: 2017/09 / ver.1.0 | I0 | SDA,TX,NC | mode | J0 | J1 | JP | JU | JI | I1 | SCL,RX,PWM | TEST | 0 | 0 | 0 | 1 | 0 | 1 | 0 | 1 | 0 | 0 | PWM | UART | 0 | 1 | 0 | 1 | 0 | 1 | 1 | 0 | 0 | 1 | I2C | Battery / Supply / 5-35V